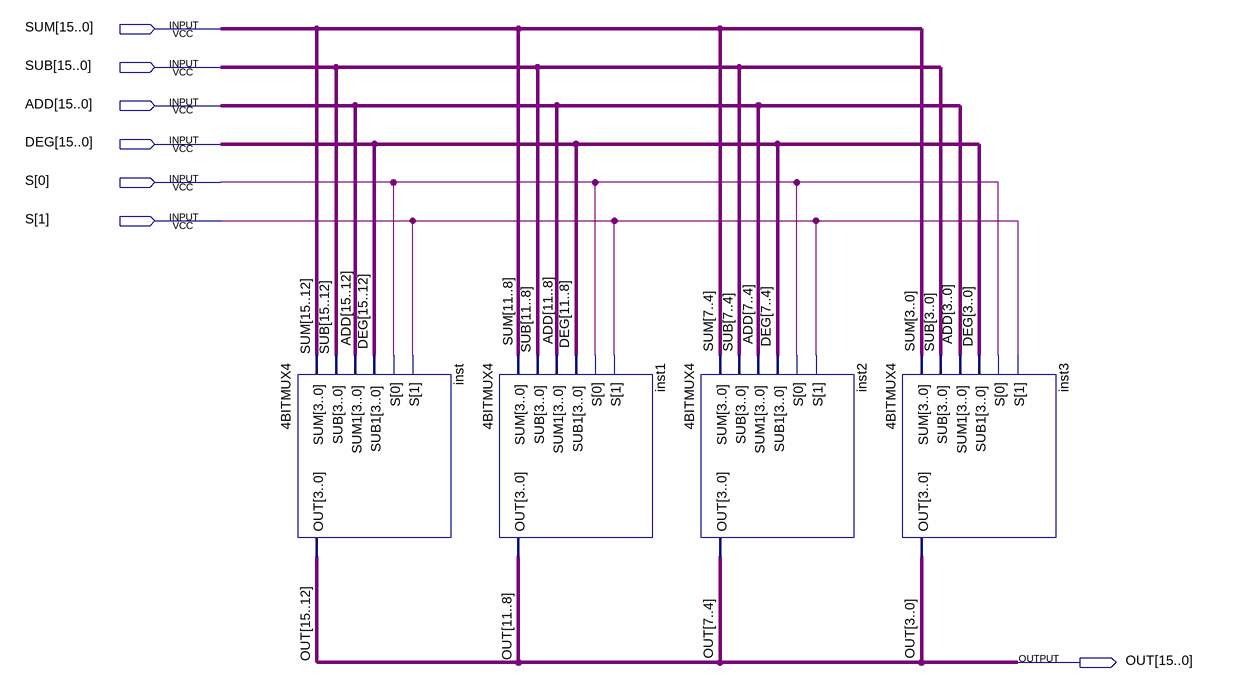
[diagram p0: schematic sheet]
// Quartus schematic 16BITMUX4.bdf as structural Verilog: 4 symbols, 7 pins
module \16BITMUX4  (
  input  [15:0] SUM,
  input  [15:0] SUB,
  input  [15:0] ADD,
  input  [15:0] DEG,
  input  [1:0] S,
  output [15:0] OUT
);

  \4BITMUX4  inst (.SUM(SUM[15:12]), .SUB(SUB[15:12]), .SUM1(ADD[15:12]), .SUB1(DEG[15:12]), .S(S), .OUT(OUT[15:12]));
  \4BITMUX4  inst1 (.SUM(SUM[11:8]), .SUB(SUB[11:8]), .SUM1(ADD[11:8]), .SUB1(DEG[11:8]), .S(S), .OUT(OUT[11:8]));
  \4BITMUX4  inst2 (.SUM(SUM[7:4]), .SUB(SUB[7:4]), .SUM1(ADD[7:4]), .SUB1(DEG[7:4]), .S(S), .OUT(OUT[7:4]));
  \4BITMUX4  inst3 (.SUM(SUM[3:0]), .SUB(SUB[3:0]), .SUM1(ADD[3:0]), .SUB1(DEG[3:0]), .S(S), .OUT(OUT[3:0]));
endmodule
